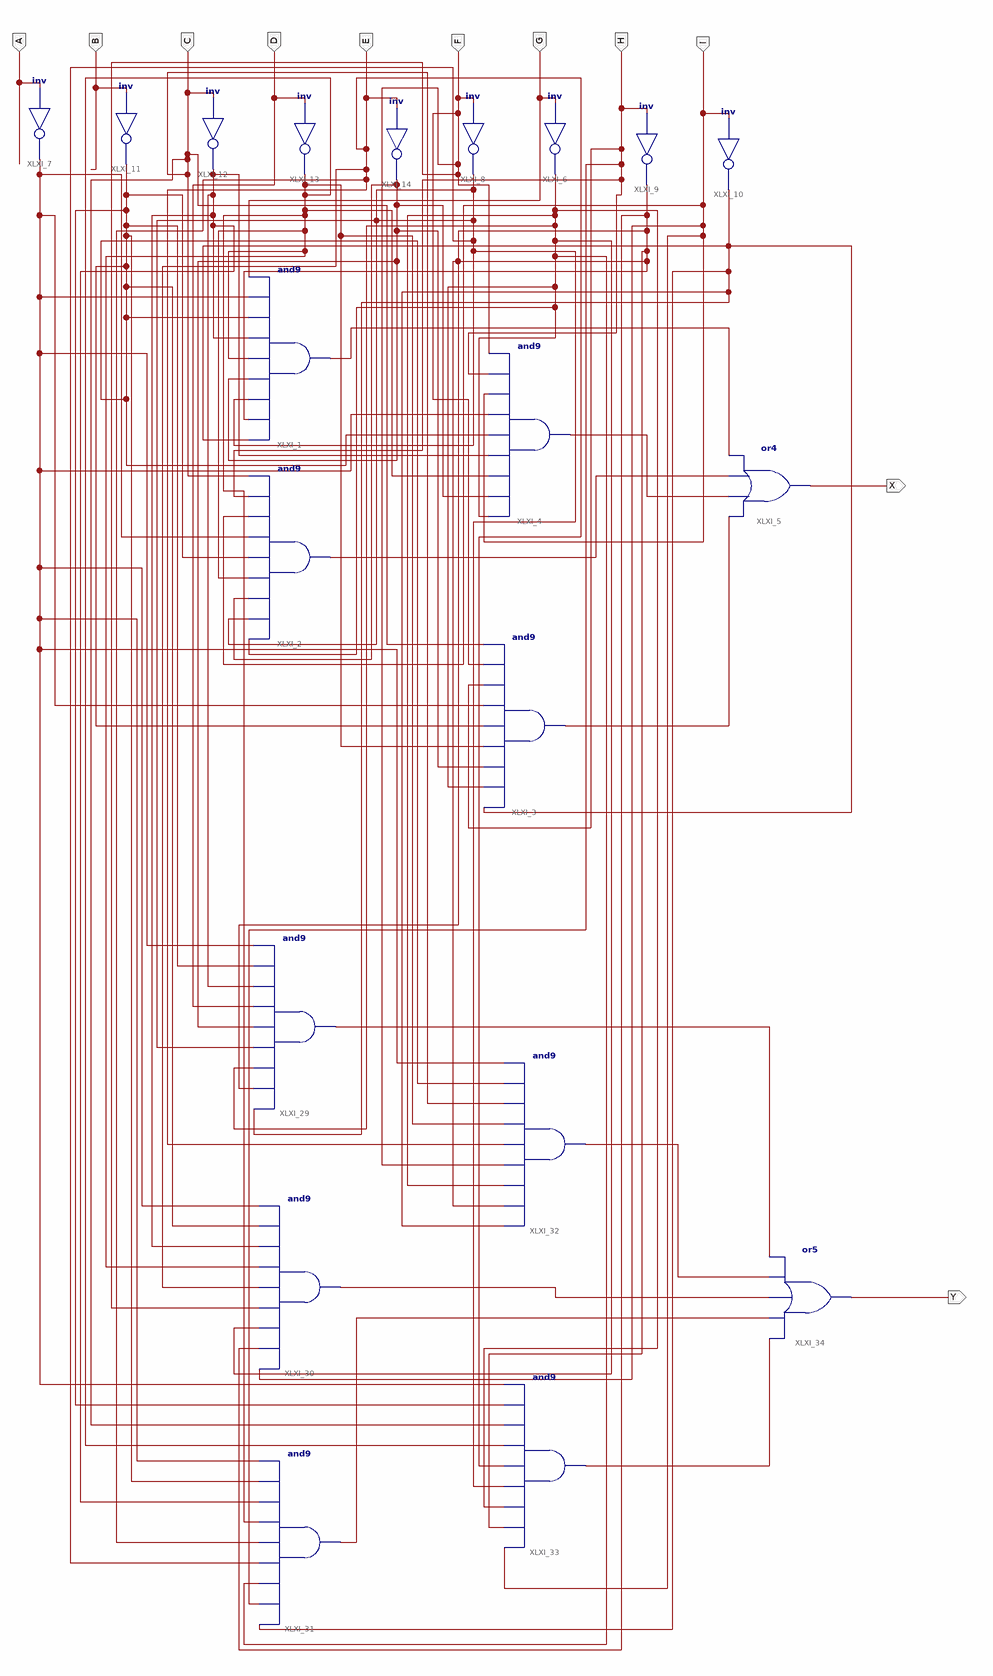
[diagram p0: schematic sheet 1]
// Xilinx ISE schematic circuito.sch (artix7) as structural Verilog: 20 symbols, 11 ports
module circuito (
  input  G,
  input  H,
  input  E,
  input  D,
  input  C,
  input  B,
  input  A,
  input  F,
  input  I,
  output X,
  output Y
);

  wire XLXN_19, XLXN_20, XLXN_21, XLXN_22, XLXN_60, XLXN_61, XLXN_62, XLXN_129, XLXN_140, XLXN_141, XLXN_142,
       XLXN_143, XLXN_144, XLXN_154, XLXN_156, XLXN_159, XLXN_161, XLXN_162;

  and XLXI_1 (XLXN_19, XLXN_159, XLXN_162, XLXN_156, XLXN_129, XLXN_154, XLXN_62, XLXN_61, XLXN_60, G);
  and XLXI_2 (XLXN_20, XLXN_161, XLXN_156, XLXN_129, XLXN_154, XLXN_61, XLXN_60, I, H, C);
  and XLXI_3 (XLXN_22, XLXN_159, XLXN_161, XLXN_129, XLXN_154, XLXN_61, XLXN_60, H, F, C);
  and XLXI_4 (XLXN_21, XLXN_161, XLXN_129, XLXN_154, XLXN_62, XLXN_61, XLXN_60, I, H, F);
  or XLXI_5 (X, XLXN_22, XLXN_21, XLXN_20, XLXN_19);
  not XLXI_8 (XLXN_156, F);
  not XLXI_6 (XLXN_161, G);
  not XLXI_9 (XLXN_162, H);
  not XLXI_10 (XLXN_159, I);
  not XLXI_7 (XLXN_60, A);
  not XLXI_11 (XLXN_61, B);
  not XLXI_12 (XLXN_62, C);
  not XLXI_13 (XLXN_154, D);
  not XLXI_14 (XLXN_129, E);
  and XLXI_29 (XLXN_140, XLXN_159, XLXN_162, XLXN_161, XLXN_156, XLXN_129, D, XLXN_62, XLXN_61, XLXN_60);
  and XLXI_30 (XLXN_142, I, XLXN_162, XLXN_161, F, E, XLXN_154, XLXN_62, XLXN_61, XLXN_60);
  and XLXI_31 (XLXN_144, XLXN_159, H, XLXN_161, XLXN_156, E, XLXN_154, XLXN_62, XLXN_61, XLXN_60);
  and XLXI_32 (XLXN_141, XLXN_159, XLXN_162, XLXN_161, F, E, XLXN_154, C, XLXN_61, XLXN_60);
  and XLXI_33 (XLXN_143, I, XLXN_162, XLXN_161, XLXN_156, E, XLXN_154, C, XLXN_61, XLXN_60);
  or XLXI_34 (Y, XLXN_143, XLXN_144, XLXN_142, XLXN_141, XLXN_140);
endmodule
